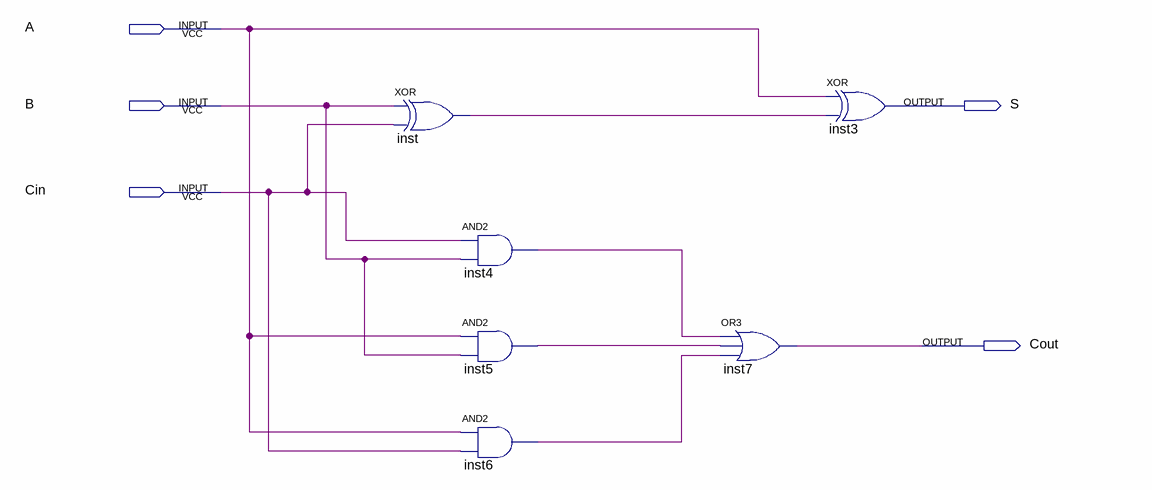
[diagram p0: schematic sheet]
// Quartus schematic Somador.bdf as structural Verilog: 6 symbols, 5 pins
module Somador (
  input  A,
  input  B,
  input  Cin,
  output S,
  output Cout
);

  wire inst4_out, inst5_out, inst6_out, inst_out;

  xor inst (inst_out, B, Cin);
  and inst4 (inst4_out, Cin, B);
  and inst5 (inst5_out, A, B);
  and inst6 (inst6_out, A, Cin);
  or inst7 (Cout, inst4_out, inst5_out, inst6_out);
  xor inst3 (S, A, inst_out);
endmodule
